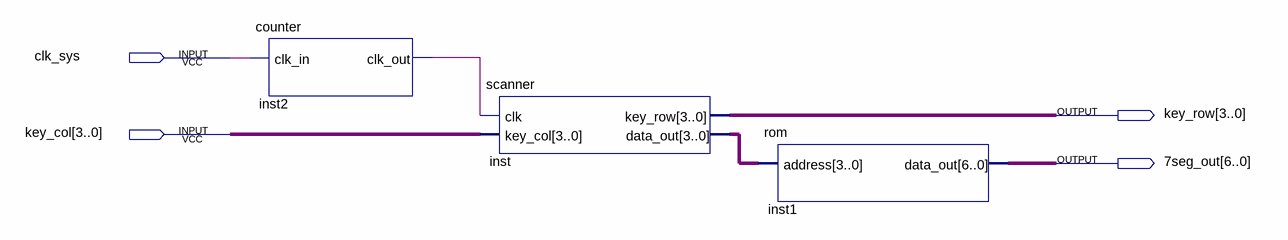
[diagram p0: schematic sheet]
// Quartus schematic 12keyboard.bdf as structural Verilog: 3 symbols, 4 pins
module \12keyboard  (
  input  clk_sys,
  input  [3:0] key_col,
  output [3:0] key_row,
  output [6:0] \7seg_out 
);

  wire inst2_clk_out;
  wire [3:0] inst_data_out;

  counter inst2 (.clk_in(clk_sys), .clk_out(inst2_clk_out));
  scanner inst (.clk(inst2_clk_out), .key_col(key_col), .key_row(key_row), .data_out(inst_data_out));
  rom inst1 (.address(inst_data_out), .data_out(\7seg_out ));
endmodule
